# Altium schematic sheet Sheet1.SchDoc
size A4; SheetNumber: 1; SheetTotal: 1
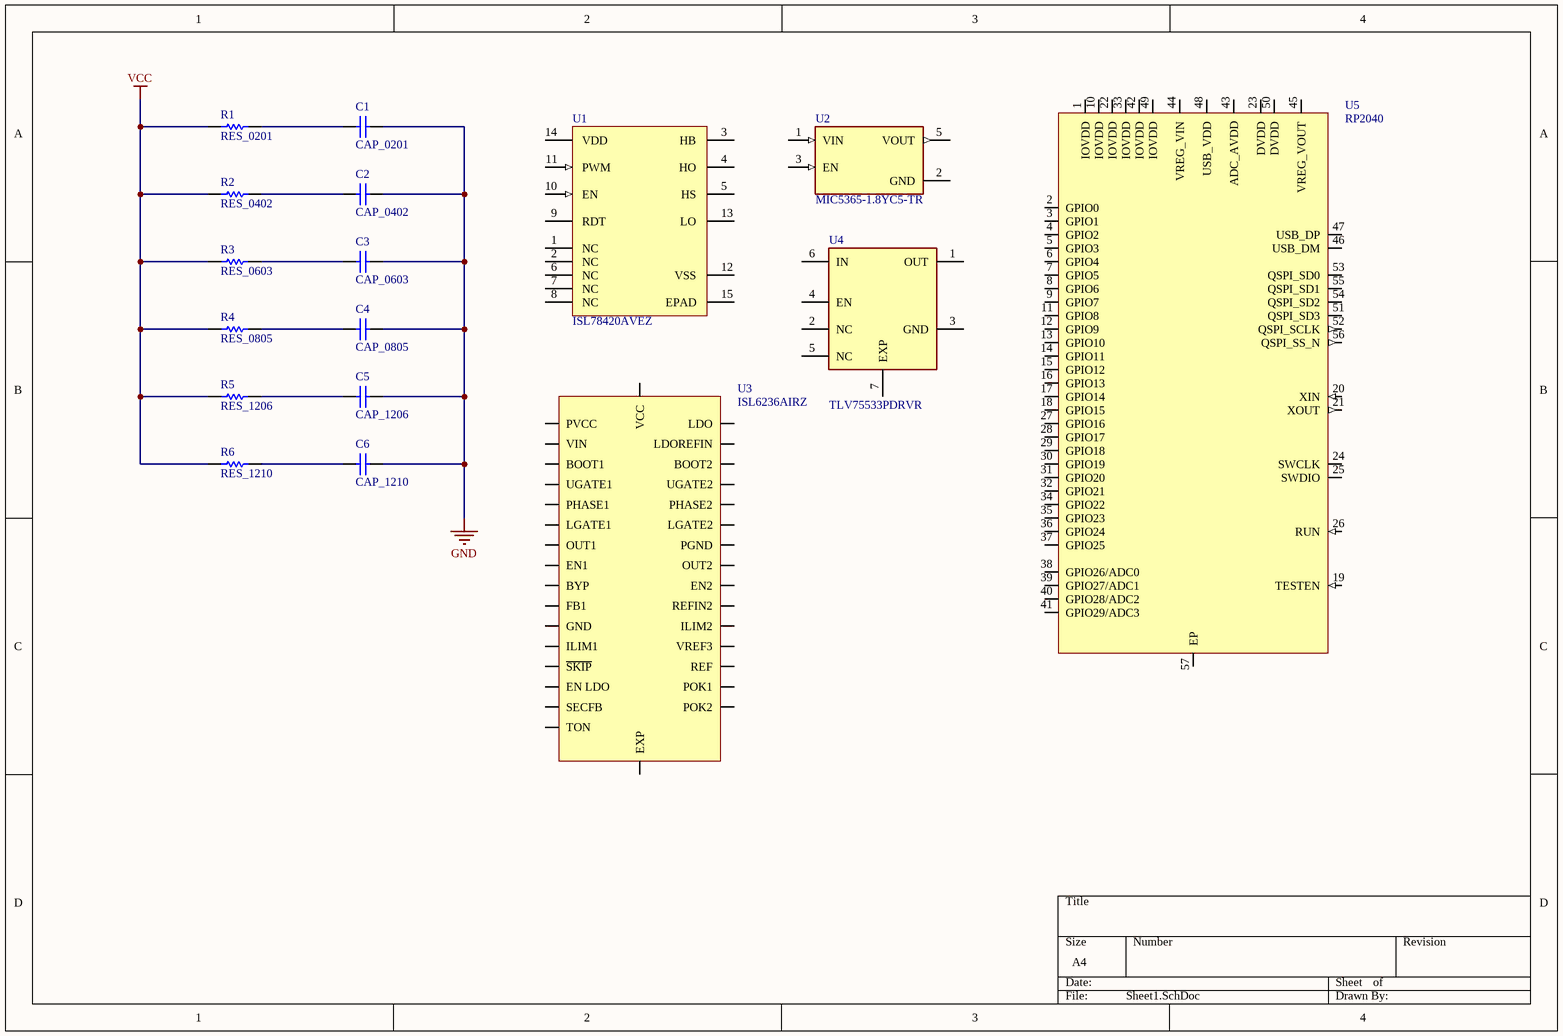
[diagram p0: Sheet1.SchDoc]

## Parts
C1  CAP_0201  [CAP_0201]
C2  CAP_0402  [CAP_0402]
C3  CAP_0603  [CAP_0603]
C4  CAP_0805  [CAP_0805]
C5  CAP_1206  [CAP_1206]
C6  CAP_1210  [CAP_1210]
R1  RES_0201  [RES_0201]
R2  RES_0402  [RES_0402]
R3  RES_0603  [RES_0603]
R4  RES_0805  [RES_0805]
R5  RES_1206  [RES_1206]
R6  RES_1210  [RES_1210]
U1  ISL78420AVEZ  [ISL78420AVEZ]
U2  MIC5365-1.8YC5-TR  [MIC5365-1.8YC5-TR]
U3  ISL6236AIRZ  [L32.5x5B]
U4  TLV75533PDRVR  [TLV75533PDRVR]
U5  RP2040  [QFN-56-EP]

## Nets
GND: C1.2 C2.2 C3.2 C4.2 C5.2 C6.2
VCC: R1.1 R2.1 R3.1 R4.1 R5.1 R6.1
NetC1_1: C1.1 R1.2
NetC2_1: C2.1 R2.2
NetC3_1: C3.1 R3.2
NetC4_1: C4.1 R4.2
NetC5_1: C5.1 R5.2
NetC6_1: C6.1 R6.2

Not connected (* = marked no-connect by the designer): U1 1(NC) 2(NC) 3(HB) 4(HO) 5(HS) 6(NC) 7(NC) 8(NC) 9(RDT) 10(EN) 11(PWM) 12(VSS) 13(LO) 14(VDD) 15(EPAD); U2 1(VIN) 2(GND) 3(EN) 5(VOUT); U3 1(REF) 2(TON) 3(VCC) 4(EN_LDO) 5(VREF3) 6(VIN) 7(LDO) 8(LDOREFIN) 9(BYP) 10(OUT1) 11(FB1) 12(ILIM1) 13(POK1) 14(EN1) 15(UGATE1) 16(PHASE1) 17(BOOT1) 18(LGATE1) 19(PVCC) 20(SECFB) 21(GND) 22(PGND) 23(LGATE2) 24(BOOT2) 25(PHASE2) 26(UGATE2) 27(EN2) 28(POK2) 29(~{SKIP}) 30(OUT2) 31(ILIM2) 32(REFIN2) 33(EXP); U4 1(OUT) 2(NC) 3(GND) 4(EN) 5(NC) 6(IN) 7(EXP); U5 1(IOVDD) 2(GPIO0) 3(GPIO1) 4(GPIO2) 5(GPIO3) 6(GPIO4) 7(GPIO5) 8(GPIO6) 9(GPIO7) 10(IOVDD) 11(GPIO8) 12(GPIO9) 13(GPIO10) 14(GPIO11) 15(GPIO12) 16(GPIO13) 17(GPIO14) 18(GPIO15) 19(TESTEN) 20(XIN) 21(XOUT) 22(IOVDD) 23(DVDD) 24(SWCLK) 25(SWDIO) 26(RUN) 27(GPIO16) 28(GPIO17) 29(GPIO18) 30(GPIO19) 31(GPIO20) 32(GPIO21) 33(IOVDD) 34(GPIO22) 35(GPIO23) 36(GPIO24) 37(GPIO25) 38(GPIO26/ADC0) 39(GPIO27/ADC1) 40(GPIO28/ADC2) 41(GPIO29/ADC3) 42(IOVDD) 43(ADC_AVDD) 44(VREG_VIN) 45(VREG_VOUT) 46(USB_DM) 47(USB_DP) 48(USB_VDD) 49(IOVDD) 50(DVDD) 51(QSPI_SD3) 52(QSPI_SCLK) 53(QSPI_SD0) 54(QSPI_SD2) 55(QSPI_SD1) 56(QSPI_SS_N) 57(EP)

## Library data of the parts
C1 = CAP_0201: Capacitor SMD 0201 Generic; Manufacturer: *; Manufacturer Part Number: *; Tolerance: *; Package Size: *; LCSC Part Number: *
C2 = CAP_0402: Capacitor SMD 0402 Generic; Manufacturer: *; Manufacturer Part Number: *; Tolerance: *; Package Size: *; LCSC Part Number: *
C3 = CAP_0603: Capacitor SMD 0603 Generic; Manufacturer: *; Manufacturer Part Number: *; Tolerance: *; Package Size: *; LCSC Part Number: *
C4 = CAP_0805: Capacitor SMD 0805 Generic; Manufacturer: *; Manufacturer Part Number: *; Tolerance: *; Package Size: *; LCSC Part Number: *
C5 = CAP_1206: Capacitor SMD 1206 Generic; Manufacturer: *; Manufacturer Part Number: *; Tolerance: *; Package Size: *; LCSC Part Number: *
C6 = CAP_1210: Capacitor SMD 1210 Generic; Manufacturer: *; Manufacturer Part Number: *; Tolerance: *; Package Size: *; LCSC Part Number: *
R1 = RES_0201: Resistor SMD 0201 Generic; Manufacturer: *; Manufacturer Part Number: *; Tolerance: *; Package Size: *; LCSC Part Number: *
R2 = RES_0402: Resistor SMD 0402 Generic; Manufacturer: *; Manufacturer Part Number: *; Tolerance: *; Package Size: *; LCSC Part Number: *
R3 = RES_0603: Resistor SMD 0603 Generic; Manufacturer: *; Manufacturer Part Number: *; Tolerance: *; Package Size: *; LCSC Part Number: *
R4 = RES_0805: Resistor SMD 0805 Generic; Manufacturer: *; Manufacturer Part Number: *; Tolerance: *; Package Size: *; LCSC Part Number: *
R5 = RES_1206: Resistor SMD 1206 Generic; Manufacturer: *; Manufacturer Part Number: *; Tolerance: *; Package Size: *; LCSC Part Number: *
R6 = RES_1210: Resistor SMD 1210 Generic; Manufacturer: *; Manufacturer Part Number: *; Tolerance: *; Package Size: *; LCSC Part Number: *
U1 = ISL78420AVEZ: Renesas Electronics 14Pin gate driver module, 100VPower, HTSSOP 16encapsulation; Manufacturer Lifecycle Status: ACTIVE; Channel Type: Synchronous; Fall Time: 10ns; Max Output current: 2A; Max Power Dissipation: 3.5W; Max Supply Current: 4mA; Max Supply Voltage: 14V; Min Supply Voltage: 8V; Nominal Supply Voltage (DC): 12V; Number of Channels: 1; Number of Drivers: 2; Output Type: Voltage; Pitch: 700µm; Propagation Delay: 60ns; Supplier: Farnell; Supplier Part Number: ISL78420AVEZ; Manufacturer: Renesas; Manufacturer Part Number: ISL78420AVEZ; RoHS: Compliant; Category: Gate Drivers; Stock: 41; Pricing: 1=1, 10=26.15, 25=24.11, 50=23.06, 100=21.97, 250=20.92, 500=20.03 (EUR); Country of Origin: Malaysia; Export Control Classification Number (ECCN) Code: EAR99; Part Family: ISL78420; Height: 0m; Height - Seated (Max): 1.2mm; Harmonized Tariff Schedule (HTS) Code: 8540000000; Introduction Date: 2014-11-06; Length: 5mm; Lifecycle Status: Production; Max Operating Temperature: 125°C; Min Operating Temperature: -40°C; MSL: 3; Mounting Technology: Surface Mount; Number of Circuits: 1; Number of Outputs: 2; Pins: 14; Number of Terminals: 14; Radiation Hardening: No; Ratings: AEC-Q100; REACH SVHC: Unaffected; Terminal Pitch: 650µm; Width: 4.4mm; ComponentLink1URL: https://datasheet.octopart.com:443/ISL78420AVEZ-Renesas-datasheet-117116799.pdf?src-supplier=IHS; ComponentLink1Description: https://datasheet.octopart.com:443/ISL78420AVEZ-Renesas-datasheet-117116799.pdf?src-supplier=IHS; ComponentLink2URL: https://datasheet.octopart.com:443/ISL78420AVEZ-Renesas-datasheet-41199385.pdf?src-supplier=IHS; ComponentLink2Description: https://datasheet.octopart.com:443/ISL78420AVEZ-Renesas-datasheet-41199385.pdf?src-supplier=IHS; ComponentLink3URL: https://datasheet.octopart.com:443/ISL78420AVEZ-Renesas-datasheet-179183120.pdf?src-supplier=Integrated+Device+Technology; ComponentLink3Description: https://datasheet.octopart.com:443/ISL78420AVEZ-Renesas-datasheet-179183120.pdf?src-supplier=Integrated+Device+Technology; ComponentLink4URL: https://datasheet.octopart.com:443/ISL78420AVEZ-Renesas-datasheet-149187688.pdf?src-supplier=Integrated+Device+Technology; ComponentLink4Description: https://datasheet.octopart.com:443/ISL78420AVEZ-Renesas-datasheet-149187688.pdf?src-supplier=Integrated+Device+Technology; ComponentLink5URL: https://datasheet.octopart.com:443/ISL78420AVEZ-Intersil-datasheet-37096373.pdf?src-supplier=Newark; ComponentLink5Description: https://datasheet.octopart.com:443/ISL78420AVEZ-Intersil-datasheet-37096373.pdf?src-supplier=Newark; ComponentLink6URL: https://datasheet.octopart.com:443/ISL78420AVEZ-Intersil-datasheet-32868520.pdf?src-supplier=Intersil; ComponentLink6Description: https://datasheet.octopart.com:443/ISL78420AVEZ-Intersil-datasheet-32868520.pdf?src-supplier=Intersil; ComponentLink7URL: http://sigma.octopart.com:80/reach_statement/Renesas-company-45.pdf?src-supplier=Compliance+Statements; ComponentLink7Description: http://sigma.octopart.com:80/reach_statement/Renesas-company-45.pdf?src-supplier=Compliance+Statements; ComponentLink8URL: http://sigma.octopart.com:80/conflict_mineral_statement/Renesas-company-44.pdf?src-supplier=Compliance+Statements; ComponentLink8Description: http://sigma.octopart.com:80/conflict_mineral_statement/Renesas-company-44.pdf?src-supplier=Compliance+Statements; LCSC Part Number: *
U2 = MIC5365-1.8YC5-TR: Linear Voltage Regulator IC Positive Fixed 1 Output 150mA SC-70-5; MF: Microchip; SnapEDA_Link: https://www.snapeda.com/parts/MIC5365-1.8YC5-TR/Microchip/view-part/?ref=snap; Package: SC-70-5 Microchip; Value: *; MP: MIC5365-1.8YC5-TR; Check_prices: https://www.snapeda.com/parts/MIC5365-1.8YC5-TR/Microchip/view-part/?ref=eda
U3 = ISL6236AIRZ: Soft Sw PWM Cntrlr 2-OUT Power Supply Controller 200KHz/300KHz/400KHz/500KHz 32-Pin QFN EP; Manufacturer: Renesas; Manufacturer Lifecycle Status: OBSOLETE; Efficiency: 97%; Frequency: 500kHz; Max Supply Voltage: 25V; Max Junction Temperature (Tj): 150°C; Max Output current: 3.3A; Min Input Voltage: 5.5V; Min Supply Voltage: 4.5V; Min Switching Frequency: 25kHz; Nominal Supply Voltage: 12V; Nominal Output Voltage: 1.05V; Number of Circuits: 1; Number of Outputs: 2; Output Current: 20A; Pitch: 500µm; Switching Frequency: 37kHz; Topology: Buck, Push-Pull; Supplier: RS; Supplier Part Number: 2627252; Manufacturer Part Number: ISL6236AIRZ; RoHS: Compliant; Category: Voltage Regulators - Switching; Stock: 44; Pricing: 1=55.55, 10=50.27, 25=47.72, 120=41.51, 300=39.42 (DKK); Case/Package: QFN; Country of Origin: Taiwan; Export Control Classification Number (ECCN) Code: EAR99; Part Family: ISL6236A; Height: 900µm; Height - Seated (Max): 1mm; Harmonized Tariff Schedule (HTS) Code: 8542.39.00.60; Introduction Date: 2017-11-10; Lead Free: Lead Free; Length: 5mm; Lifecycle Status: Obsolete; LTB Date: 2025-09-04; LTD Date: 2026-03-04; Max Operating Temperature: 100°C; Max Switching Frequency: 500kHz; Min Operating Temperature: -40°C; MSL: 3; Mounting Technology: Surface Mount; Pins: 32; Number of Terminals: 32; Output Voltage: 5.5V; Radiation Hardening: No; REACH SVHC: Unaffected; Temperature Grade: Industrial; Terminal Pitch: 500µm; Width: 5mm; ComponentLink1URL: https://datasheet.octopart.com:443/ISL6236AIRZ-Renesas-datasheet-149187364.pdf?src-supplier=Integrated+Device+Technology; ComponentLink1Description: https://datasheet.octopart.com:443/ISL6236AIRZ-Renesas-datasheet-149187364.pdf?src-supplier=Integrated+Device+Technology; ComponentLink2URL: https://datasheet.octopart.com:443/ISL6236AIRZ-Renesas-datasheet-179182849.pdf?src-supplier=Integrated+Device+Technology; ComponentLink2Description: https://datasheet.octopart.com:443/ISL6236AIRZ-Renesas-datasheet-179182849.pdf?src-supplier=Integrated+Device+Technology; ComponentLink3URL: https://datasheet.octopart.com:443/ISL6236AIRZ-Renesas-datasheet-14388266.pdf?src-supplier=IHS; ComponentLink3Description: https://datasheet.octopart.com:443/ISL6236AIRZ-Renesas-datasheet-14388266.pdf?src-supplier=IHS; ComponentLink4URL: https://datasheet.octopart.com:443/ISL6236AIRZ-Renesas-datasheet-138160199.pdf?src-supplier=Future+Electronics; ComponentLink4Description: https://datasheet.octopart.com:443/ISL6236AIRZ-Renesas-datasheet-138160199.pdf?src-supplier=Future+Electronics; ComponentLink5URL: https://datasheet.octopart.com:443/ISL6236AIRZ-Intersil-datasheet-158443858.pdf?src-supplier=Augswan; ComponentLink5Description: https://datasheet.octopart.com:443/ISL6236AIRZ-Intersil-datasheet-158443858.pdf?src-supplier=Augswan; ComponentLink6URL: http://sigma.octopart.com:80/reach_statement/Renesas-company-45.pdf?src-supplier=Compliance+Statements; ComponentLink6Description: http://sigma.octopart.com:80/reach_statement/Renesas-company-45.pdf?src-supplier=Compliance+Statements; ComponentLink7URL: http://sigma.octopart.com:80/conflict_mineral_statement/Renesas-company-44.pdf?src-supplier=Compliance+Statements; ComponentLink7Description: http://sigma.octopart.com:80/conflict_mineral_statement/Renesas-company-44.pdf?src-supplier=Compliance+Statements; LCSC Part Number: *
U4 = TLV75533PDRVR: 500mA high-PSRR low-IQ low-dropout voltage regulator with enable 6-WSON -40 to 125; Manufacturer: Texas Instruments; Manufacturer Lifecycle Status: ACTIVE; Accuracy: 1.5%; Dropout Voltage: 250mV; Max Junction Temperature (Tj): 125°C; Max Supply Voltage: 5.5V; Min Supply Voltage: 3.55V; Nominal Supply Current: 25µA; Number of Channels: 1; Output Voltage: 3.3V; Supplier: DigiKey; Supplier Part Number: 296-51807-6-ND; Manufacturer Part Number: TLV75533PDRVR; RoHS: Compliant; Category: LDO Voltage Regulators; Stock: 5358; Pricing: 1=0.45, 10=0.311, 25=0.2772, 100=0.24, 250=0.22232, 500=0.21166, 1000=0.20288 (USD); Height: 800µm; Length: 2mm; Lifecycle Status: Production; Max Operating Temperature: 125°C; Min Operating Temperature: -40°C; Number of Outputs: 1; Pins: 6; Output Current: 500mA; Schedule B: 8542390000; Thickness: 750µm; Width: 2mm; ComponentLink1URL: https://octopart.com:443/opatz8j6/c1?t=jz4KQYd-X30Q9oOq83RN8Q7LJxgnjgc-4qjjpnbq5ibPyNQ9C1qmgU9l-Mq4lcrjrxNSMc1fBezVCBvvAiMb2CiEwv4XU2kB3ULQci-AKl7rOna3sWz9khra6j3WMNF6umiBxhVnqs4fyYOWhNE2PFYe70JvyT66uIYe3PcBjJPV9rj2Op8s1nt1envjIjZVUY3LrhuEoL_oMCW_bmLoi1tQcpU6eGEV6lKc3ncBfJmEddXZsDRyU__fld6n-joR3AORBvJ_Vc3OVQhCrkfV5BDSB_Me-qjpyqejgDWvRq9frsyj1H2Z_N5iwNIFVTUaM6S0AsYGC3S5REzTpAfo67I7hxePwPhy6LENuZ1lk9DMUkgUFbrXIbVKEpYMLRYkCMjcSg&src-supplier=Texas+Instruments; ComponentLink1Description: https://octopart.com:443/opatz8j6/c1?t=jz4KQYd-X30Q9oOq83RN8Q7LJxgnjgc-4qjjpnbq5ibPyNQ9C1qmgU9l-Mq4lcrjrxNSMc1fBezVCBvvAiMb2CiEwv4XU2kB3ULQci-AKl7rOna3sWz9khra6j3WMNF6umiBxhVnqs4fyYOWhNE2PFYe70JvyT66uIYe3PcBjJPV9rj2Op8s1nt1envjIjZVUY3LrhuEoL_oMCW_bmLoi1tQcpU6eGEV6lKc3ncBfJmEddXZsDRyU__fld6n-joR3AORBvJ_Vc3OVQhCrkfV5BDSB_Me-qjpyqejgDWvRq9frsyj1H2Z_N5iwNIFVTUaM6S0AsYGC3S5REzTpAfo67I7hxePwPhy6LENuZ1lk9DMUkgUFbrXIbVKEpYMLRYkCMjcSg&src-supplier=Texas+Instruments; ComponentLink2URL: https://sigma.octopart.com:443/101810328/technical_drawing/Texas-Instruments-TLV75533PDRVR.pdf?src-supplier=Texas+Instruments; ComponentLink2Description: https://sigma.octopart.com:443/101810328/technical_drawing/Texas-Instruments-TLV75533PDRVR.pdf?src-supplier=Texas+Instruments; ComponentLink3URL: https://datasheet.octopart.com:443/TLV75533PDRVR-Texas-Instruments-datasheet-148775085.pdf?src-supplier=Upverter; ComponentLink3Description: https://datasheet.octopart.com:443/TLV75533PDRVR-Texas-Instruments-datasheet-148775085.pdf?src-supplier=Upverter; ComponentLink4URL: https://datasheet.octopart.com:443/TLV75533PDRVR-Texas-Instruments-datasheet-150455022.pdf?src-supplier=Augswan; ComponentLink4Description: https://datasheet.octopart.com:443/TLV75533PDRVR-Texas-Instruments-datasheet-150455022.pdf?src-supplier=Augswan; ComponentLink5URL: https://datasheet.octopart.com:443/TLV75533PDRVR-Texas-Instruments-datasheet-165804640.pdf?src-supplier=LCSC; ComponentLink5Description: https://datasheet.octopart.com:443/TLV75533PDRVR-Texas-Instruments-datasheet-165804640.pdf?src-supplier=LCSC; ComponentLink6URL: http://sigma.octopart.com:80/reach_statement/Texas-Instruments-company-64.pdf?src-supplier=Compliance+Statements; ComponentLink6Description: http://sigma.octopart.com:80/reach_statement/Texas-Instruments-company-64.pdf?src-supplier=Compliance+Statements; ComponentLink7URL: http://sigma.octopart.com:80/conflict_mineral_statement/Texas-Instruments-company-63.pdf?src-supplier=Compliance+Statements; ComponentLink7Description: http://sigma.octopart.com:80/conflict_mineral_statement/Texas-Instruments-company-63.pdf?src-supplier=Compliance+Statements; LCSC Part Number: *
U5 = RP2040: Raspberry Pi RP2040 MCU